# EAGLE schematic NEMOTIC HORSE (EAGLE 9.6.2)
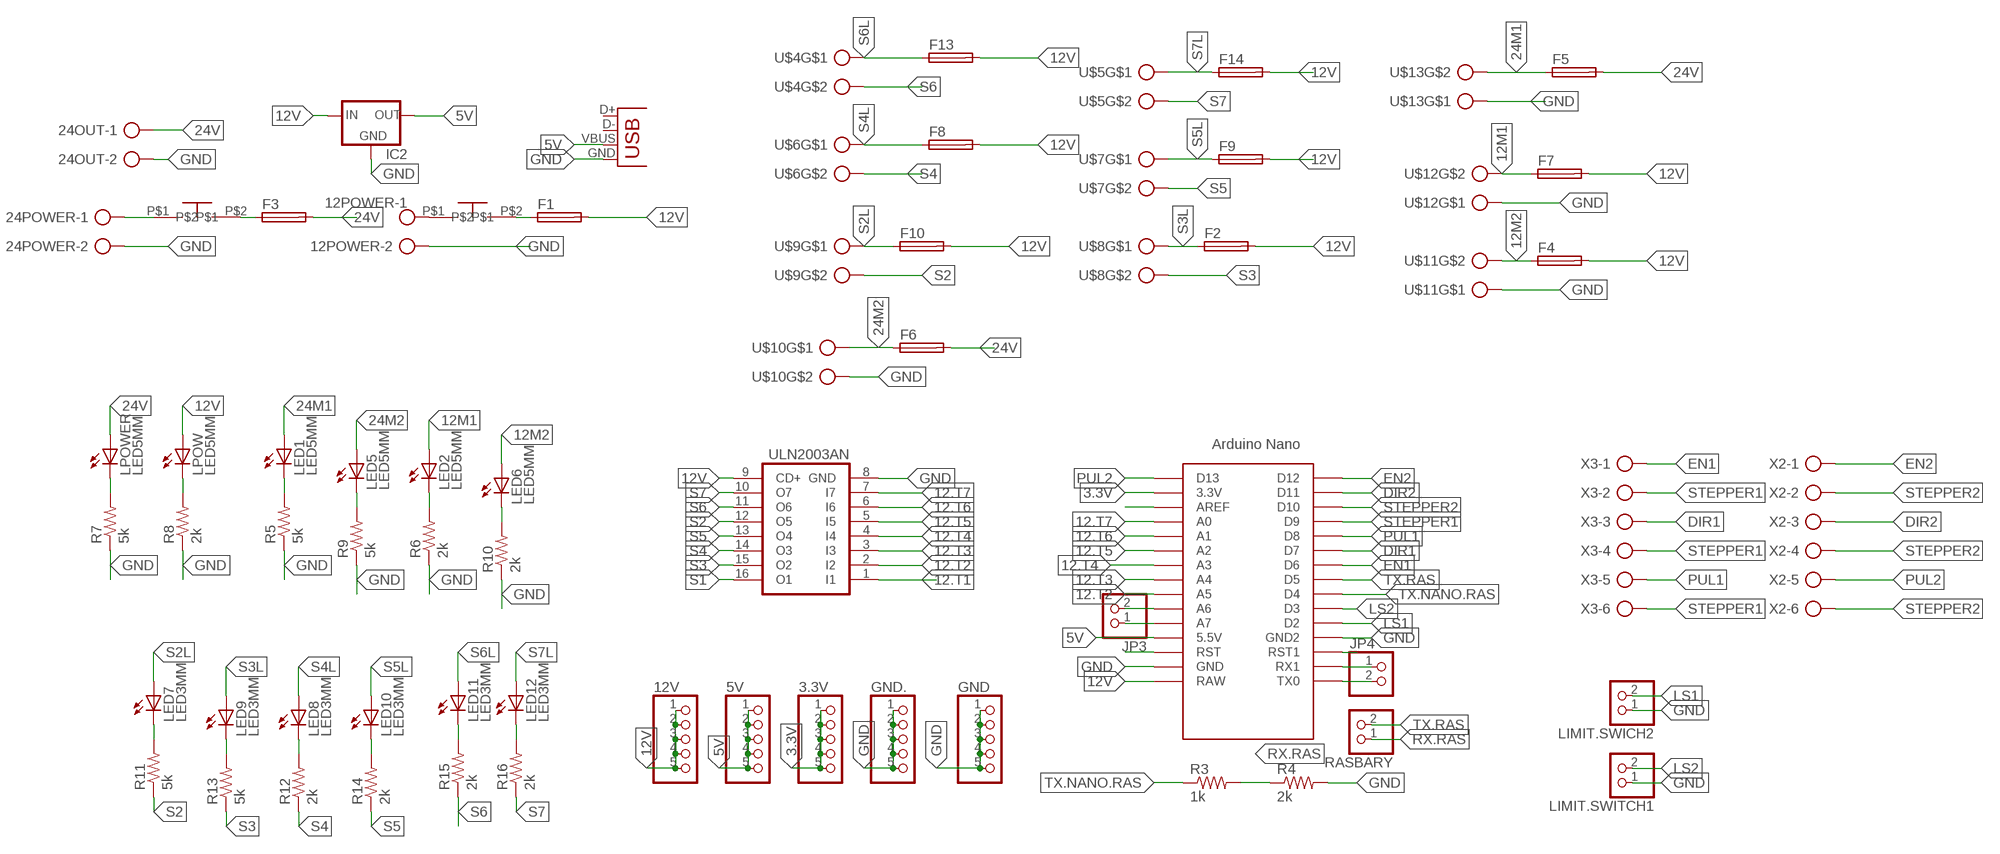
[diagram p0: schematic, sheet 1]

## Parts
3.3V  PINHD-1X5  [1X05]
5V  PINHD-1X5  [1X05]
12POWER  ROSTA.POWER  [W239-302]
12V  PINHD-1X5  [1X05]
24OUT  ROSTA.POWER  [W239-302]
24POWER  ROSTA.POWER  [W239-302]
F1  FUSE_HOLDER  [SH22,5A]
F2  FUSE_HOLDER  [SH22,5A]
F3  FUSE_HOLDER  [SH22,5A]
F4  FUSE_HOLDER  [SH22,5A]
F5  FUSE_HOLDER  [SH22,5A]
F6  FUSE_HOLDER  [SH22,5A]
F7  FUSE_HOLDER  [SH22,5A]
F8  FUSE_HOLDER  [SH22,5A]
F9  FUSE_HOLDER  [SH22,5A]
F10  FUSE_HOLDER  [SH22,5A]
F13  FUSE_HOLDER  [SH22,5A]
F14  FUSE_HOLDER  [SH22,5A]
GND  PINHD-1X5  [1X05]
GND.  PINHD-1X5  [1X05]
IC1  ULN2003AN  [DIL16]
IC2  78XXS  [78XXS]
JP3  PINHD-1X2  [1X02]
JP4  PINHD-1X2  [1X02]
LED1  LED5MM  [LED5MM]
LED2  LED5MM  [LED5MM]
LED5  LED5MM  [LED5MM]
LED6  LED5MM  [LED5MM]
LED7  LED3MM  [LED3MM]
LED8  LED3MM  [LED3MM]
LED9  LED3MM  [LED3MM]
LED10  LED3MM  [LED3MM]
LED11  LED3MM  [LED3MM]
LED12  LED3MM  [LED3MM]
LIMIT.SWICH2  PINHD-1X2  [1X02]
LIMIT.SWITCH1  PINHD-1X2  [1X02]
LPOW  LED5MM  [LED5MM]
LPOWER  LED5MM  [LED5MM]
R3  1k  RES-7  [0204/7]
R4  2k  RES-7  [0204/7]
R5  5k  RES-7  [0204/7]
R6  2k  RES-7  [0204/7]
R7  5k  R-US_0204/7  [0204/7]
R8  2k  RES-7  [0204/7]
R9  5k  RES-7  [0204/7]
R10  2k  RES-7  [0204/7]
R11  5k  RES-5  [0204/5]
R12  2k  RES-5  [0204/5]
R13  5k  RES-5  [0204/5]
R14  2k  RES-5  [0204/5]
R15  2k  RES-5  [0204/5]
R16  2k  RES-5  [0204/5]
RASBARY  PINHD-1X2  [1X02]
RASBERY.POWER  USB-A-H  [USB-A-H]
U$1  ARDUINO_NANO  [NANO]
U$2  SWITCH_2  [ON_OFF]
U$3  SWITCH_2  [ON_OFF]
U$4  CON_PTR_2  [AK300/2]
U$5  CON_PTR_2  [AK300/2]
U$6  CON_PTR_2  [AK300/2]
U$7  CON_PTR_2  [AK300/2]
U$8  CON_PTR_2  [AK300/2]
U$9  CON_PTR_2  [AK300/2]
U$10  CON_PTR_2  [AK300/2]
U$11  CON_PTR_2  [AK300/2]
U$12  CON_PTR_2  [AK300/2]
U$13  CON_PTR_2  [AK300/2]
X2  CON_PTR_6  [AK300/6]
X3  CON_PTR_6  [AK300/6]

## Nets
3.3V: 3.3V.1 3.3V.2 3.3V.3 3.3V.4 3.3V.5 U$1.3.3V
5V: 5V.1 5V.2 5V.3 5V.4 5V.5 IC2.OUT RASBERY.POWER.VBUS U$1.5V(5.5V)
12.T1: IC1.1(I1)
12.T2: IC1.2(I2) U$1.A5
12.T3: IC1.3(I3) U$1.A4
12.T4: IC1.4(I4) U$1.A3
12.T5: IC1.5(I5) U$1.A2
12.T6: IC1.6(I6) U$1.A1
12.T7: IC1.7(I7) U$1.A0
12M1: F7.1 LED2.A U$12.2
12M2: F4.1 LED6.A U$11.2
12V: 12V.1 12V.2 12V.3 12V.4 12V.5 F1.2 F2.2 F4.2 F7.2 F8.2 F9.2 F10.2 F13.2 F14.2 IC1.9(CD+) IC2.IN LPOW.A U$1.RAW
24M1: F5.1 LED1.A U$13.2
24M2: F6.1 LED5.A U$10.1
24V: 24OUT.1 F3.2 F5.2 F6.2 LPOWER.A
DIR1: U$1.D7 X3.3
DIR2: U$1.D11 X2.3
EN1: U$1.D6 X3.1
EN2: U$1.D12 X2.1
GND: 12POWER.2 24OUT.2 24POWER.2 GND.1 GND.2 GND.3 GND.4 GND.5 GND..1 GND..2 GND..3 GND..4 GND..5 IC1.8(GND) IC2.GND LIMIT.SWICH2.1 LIMIT.SWITCH1.1 R4.2 R5.1 R6.1 R7.1 R8.1 R9.1 R10.1 RASBERY.POWER.GND U$1.GND U$1.GND1(GND2) U$10.2 U$11.1 U$12.1 U$13.1
LS1: LIMIT.SWICH2.2 U$1.D2
LS2: LIMIT.SWITCH1.2 U$1.D3
N$1: 24POWER.1 U$2.P$1
N$2: LED1.K(C) R5.2
N$4: F3.1 U$2.P$2
N$5: LED2.K(C) R6.2
N$7: LED5.K(C) R9.2
N$8: LED6.K(C) R10.2
N$9: LED7.K(C) R11.2
N$10: LPOWER.K(C) R7.2
N$11: LPOW.K(C) R8.2
N$12: LED8.K(C) R12.2
N$13: U$1.RST1
N$14: JP4.1 U$1.RX1
N$15: JP4.2 U$1.TX0
N$16: LED9.K(C) R13.2
N$18: U$1.AREF
N$19: LED10.K(C) R14.2
N$20: LED11.K(C) R15.2
N$21: LED12.K(C) R16.2
N$23: JP3.1 U$1.A7
N$25: JP3.2 U$1.A6
N$28: U$1.RST
N$36: 12POWER.1 U$3.P$1
N$37: F1.1 U$3.P$2
PUL1: U$1.D8 X3.5
PUL2: U$1.D13 X2.5
RX.RAS: R3.2 R4.1 RASBARY.1
S1: IC1.16(O1)
S2: IC1.12(O5) R11.1 U$9.2
S2L: F10.1 LED7.A U$9.1
S3: IC1.15(O2) R13.1 U$8.2
S3L: F2.1 LED9.A U$8.1
S4: IC1.14(O3) R12.1 U$6.2
S4L: F8.1 LED8.A U$6.1
S5: IC1.13(O4) R14.1 U$7.2
S5L: F9.1 LED10.A U$7.1
S6: IC1.11(O6) R15.1 U$4.2
S6L: F13.1 LED11.A U$4.1
S7: IC1.10(O7) R16.1 U$5.2
S7L: F14.1 LED12.A U$5.1
STEPPER1: U$1.D9 X3.2 X3.4 X3.6
STEPPER2: U$1.D10 X2.2 X2.4 X2.6
TX.NANO.RAS: R3.1 U$1.D4
TX.RAS: RASBARY.2 U$1.D5
Unconnected: RASBERY.POWER.D+ RASBERY.POWER.D-

## Library data of the parts
3.3V 5V 12V GND GND. = MIA_LIBRARY-2-2-2:PINHD-1X5: PIN HEADER
12POWER 24OUT 24POWER = MIA_LIBRARY-2-2-2:ROSTA.POWER: WAGO SCREW CLAMP; OC_FARNELL: unknown; OC_NEWARK: unknown
F1-F10 F13 F14 = MIA_LIBRARY-2-2-2:FUSE_HOLDER
IC1 = MIA_LIBRARY-2-2-2:ULN2003A: DRIVER ARRAY
IC2 = MIA_LIBRARY-2-2-2:78XXS: VOLTAGE REGULATOR
JP3 JP4 LIMIT.SWICH2 LIMIT.SWITCH1 RASBARY = MIA_LIBRARY-2-2-2:PINHD-1X2: PIN HEADER
LED1 LED2 LED5 LED6 LPOW LPOWER = MIA_LIBRARY-2-2-2:LED5MM
LED7-LED12 = MIA_LIBRARY-2-2-2:LED3MM
R3-R6 R8-R10 = MIA_LIBRARY-2-2-2:RES-7
R7 = rcl:R-US_: RESISTOR, American symbol; SPICEPREFIX: R
R11-R16 = MIA_LIBRARY-2-2-2:RES-5
RASBERY.POWER = MIA_LIBRARY-2-2-2:USB: USB Connectors
U$1 = MIA_LIBRARY-2-2-2:ARDUINO_NANO: Arduino Nano
U$2 U$3 = MIA_LIBRARY-2-2-2:SWITCH_2
U$4-U$13 = MIA_LIBRARY-2-2-2:CON_PTR_2
X2 X3 = MIA_LIBRARY-2-2-2:CON_PTR_6: CONNECTOR; OC_FARNELL: unknown; OC_NEWARK: unknown; SPICEPREFIX: X